# Altium schematic sheet CONNECTORS.SchDoc: =DocumentName
size B
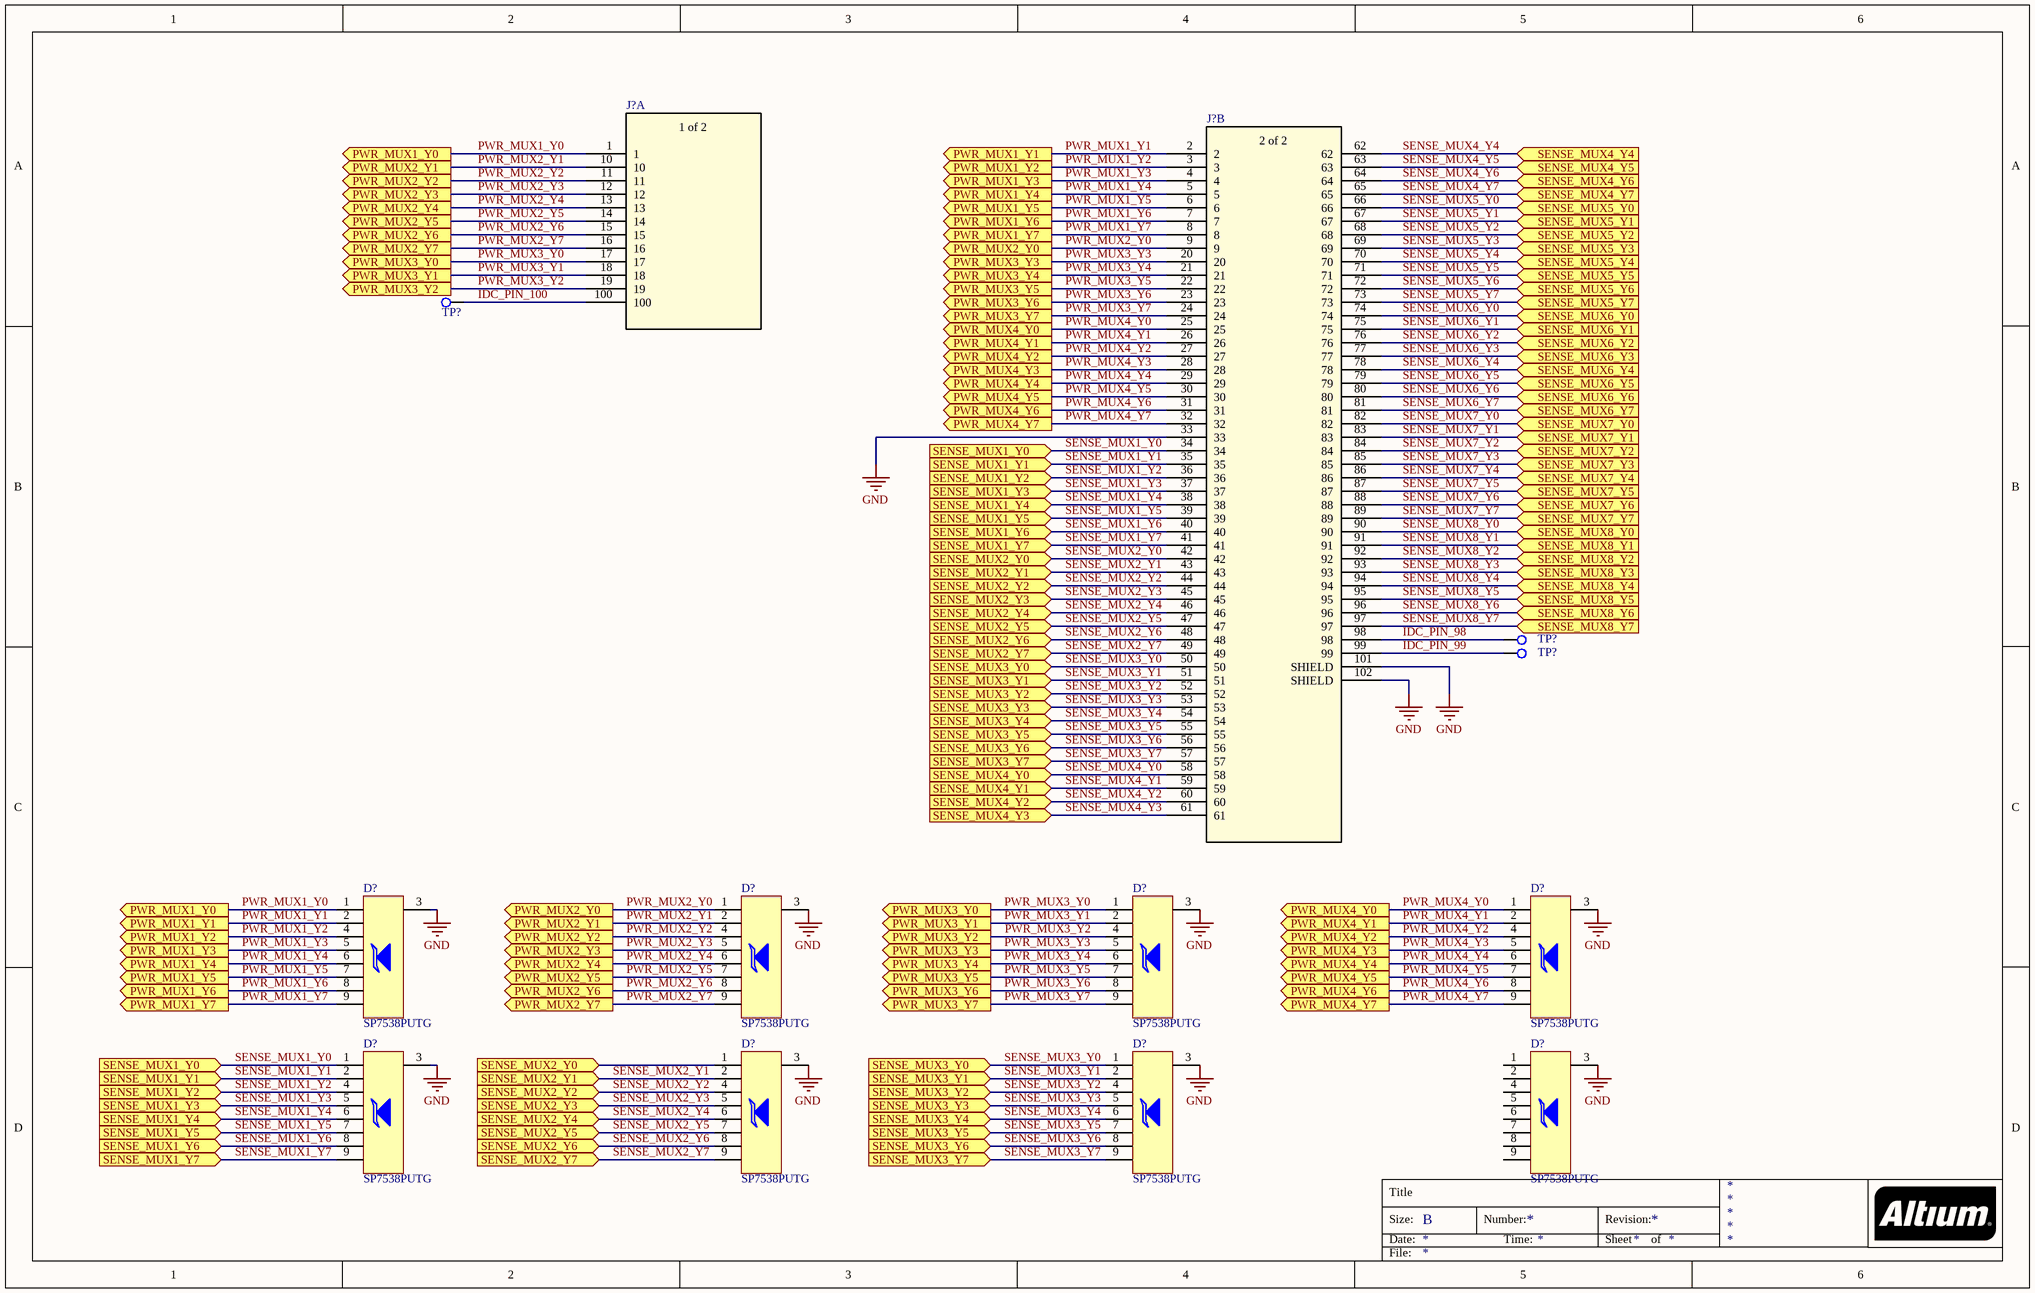
[diagram p0: CONNECTORS.SchDoc]

## Parts
(Parts that share a designator on the sheet are numbered #1, #2 ... from top to bottom, then left to right.)
D?#1  SP7538PUTG  [SP7538PUTG]
D?#2  SP7538PUTG  [SP7538PUTG]
D?#3  SP7538PUTG  [SP7538PUTG]
D?#4  SP7538PUTG  [SP7538PUTG]
D?#5  SP7538PUTG  [SP7538PUTG]
D?#6  SP7538PUTG  [SP7538PUTG]
D?#7  SP7538PUTG  [SP7538PUTG]
D?#8  SP7538PUTG  [SP7538PUTG]
J?#1  1-787082-8  [CONN100_1-787082-8_TEC]  (value not drawn)  (part A of 2)
J?#2  1-787082-8  [CONN100_1-787082-8_TEC]  (value not drawn)  (part B of 2)
TP?#1  RCU-0C  [TP+195X110]  (value not drawn)
TP?#2  RCU-0C  [TP+195X110]  (value not drawn)
TP?#3  RCU-0C  [TP+195X110]  (value not drawn)

## Ports
PWR_MUX1_Y0 (out), PWR_MUX1_Y1 (out), PWR_MUX1_Y2 (out), PWR_MUX1_Y3 (out), PWR_MUX1_Y4 (out), PWR_MUX1_Y5 (out), PWR_MUX1_Y6 (out), PWR_MUX1_Y7 (out), PWR_MUX2_Y0 (out), PWR_MUX2_Y1 (out), PWR_MUX2_Y2 (out), PWR_MUX2_Y3 (out), PWR_MUX2_Y4 (out), PWR_MUX2_Y5 (out), PWR_MUX2_Y6 (out), PWR_MUX2_Y7 (out), PWR_MUX3_Y0 (out), PWR_MUX3_Y1 (out), PWR_MUX3_Y2 (out), PWR_MUX3_Y3 (out), PWR_MUX3_Y4 (out), PWR_MUX3_Y5 (out), PWR_MUX3_Y6 (out), PWR_MUX3_Y7 (out), PWR_MUX4_Y0 (out), PWR_MUX4_Y1 (out), PWR_MUX4_Y2 (out), PWR_MUX4_Y3 (out), PWR_MUX4_Y4 (out), PWR_MUX4_Y5 (out), PWR_MUX4_Y6 (out), PWR_MUX4_Y7 (out), SENSE_MUX1_Y0 (in), SENSE_MUX1_Y1 (in), SENSE_MUX1_Y2 (in), SENSE_MUX1_Y3 (in), SENSE_MUX1_Y4 (in), SENSE_MUX1_Y5 (in), SENSE_MUX1_Y6 (in), SENSE_MUX1_Y7 (in), SENSE_MUX2_Y0 (in), SENSE_MUX2_Y1 (in), SENSE_MUX2_Y2 (in), SENSE_MUX2_Y3 (in), SENSE_MUX2_Y4 (in), SENSE_MUX2_Y5 (in), SENSE_MUX2_Y6 (in), SENSE_MUX2_Y7 (in), SENSE_MUX3_Y0 (in), SENSE_MUX3_Y1 (in), SENSE_MUX3_Y2 (in), SENSE_MUX3_Y3 (in), SENSE_MUX3_Y4 (in), SENSE_MUX3_Y5 (in), SENSE_MUX3_Y6 (in), SENSE_MUX3_Y7 (in), SENSE_MUX4_Y0 (in), SENSE_MUX4_Y1 (in), SENSE_MUX4_Y2 (in), SENSE_MUX4_Y3 (in), SENSE_MUX4_Y4 (in), SENSE_MUX4_Y5 (in), SENSE_MUX4_Y6 (in), SENSE_MUX4_Y7 (in), SENSE_MUX5_Y0 (in), SENSE_MUX5_Y1 (in), SENSE_MUX5_Y2 (in), SENSE_MUX5_Y3 (in), SENSE_MUX5_Y4 (in), SENSE_MUX5_Y5 (in), SENSE_MUX5_Y6 (in), SENSE_MUX5_Y7 (in), SENSE_MUX6_Y0 (in), SENSE_MUX6_Y1 (in), SENSE_MUX6_Y2 (in), SENSE_MUX6_Y3 (in), SENSE_MUX6_Y4 (in), SENSE_MUX6_Y5 (in), SENSE_MUX6_Y6 (in), SENSE_MUX6_Y7 (in), SENSE_MUX7_Y0 (in), SENSE_MUX7_Y1 (in), SENSE_MUX7_Y2 (in), SENSE_MUX7_Y3 (in), SENSE_MUX7_Y4 (in), SENSE_MUX7_Y5 (in), SENSE_MUX7_Y6 (in), SENSE_MUX7_Y7 (in), SENSE_MUX8_Y0 (in), SENSE_MUX8_Y1 (in), SENSE_MUX8_Y2 (in), SENSE_MUX8_Y3 (in), SENSE_MUX8_Y4 (in), SENSE_MUX8_Y5 (in), SENSE_MUX8_Y6 (in), SENSE_MUX8_Y7 (in)

## Nets
GND: D?#1.3 D?#2.3 D?#3.3 D?#4.3 D?#5.3 D?#6.3 D?#7.3 D?#8.3 J?#2.33 J?#2.101(SHIELD) J?#2.102(SHIELD)
IDC_PIN_98: J?#2.98
IDC_PIN_99: J?#2.99
IDC_PIN_100: J?#1.100
PWR_MUX1_Y0: D?#1.1 J?#1.1 ; port PWR_MUX1_Y0
PWR_MUX1_Y1: D?#1.2 J?#2.2 ; port PWR_MUX1_Y1
PWR_MUX1_Y2: D?#1.4 J?#2.3 ; port PWR_MUX1_Y2
PWR_MUX1_Y3: D?#1.5 J?#2.4 ; port PWR_MUX1_Y3
PWR_MUX1_Y4: D?#1.6 J?#2.5 ; port PWR_MUX1_Y4
PWR_MUX1_Y5: D?#1.7 J?#2.6 ; port PWR_MUX1_Y5
PWR_MUX1_Y6: D?#1.8 J?#2.7 ; port PWR_MUX1_Y6
PWR_MUX1_Y7: D?#1.9 J?#2.8 ; port PWR_MUX1_Y7
PWR_MUX2_Y0: D?#2.1 J?#2.9 ; port PWR_MUX2_Y0
PWR_MUX2_Y1: D?#2.2 J?#1.10 ; port PWR_MUX2_Y1
PWR_MUX2_Y2: D?#2.4 J?#1.11 ; port PWR_MUX2_Y2
PWR_MUX2_Y3: D?#2.5 J?#1.12 ; port PWR_MUX2_Y3
PWR_MUX2_Y4: D?#2.6 J?#1.13 ; port PWR_MUX2_Y4
PWR_MUX2_Y5: D?#2.7 J?#1.14 ; port PWR_MUX2_Y5
PWR_MUX2_Y6: D?#2.8 J?#1.15 ; port PWR_MUX2_Y6
PWR_MUX2_Y7: D?#2.9 J?#1.16 ; port PWR_MUX2_Y7
PWR_MUX3_Y0: D?#3.1 J?#1.17 ; port PWR_MUX3_Y0
PWR_MUX3_Y1: D?#3.2 J?#1.18 ; port PWR_MUX3_Y1
PWR_MUX3_Y2: D?#3.4 J?#1.19 ; port PWR_MUX3_Y2
PWR_MUX3_Y3: D?#3.5 J?#2.20 ; port PWR_MUX3_Y3
PWR_MUX3_Y4: D?#3.6 J?#2.21 ; port PWR_MUX3_Y4
PWR_MUX3_Y5: D?#3.7 J?#2.22 ; port PWR_MUX3_Y5
PWR_MUX3_Y6: D?#3.8 J?#2.23 ; port PWR_MUX3_Y6
PWR_MUX3_Y7: D?#3.9 J?#2.24 ; port PWR_MUX3_Y7
PWR_MUX4_Y0: D?#4.1 J?#2.25 ; port PWR_MUX4_Y0
PWR_MUX4_Y1: D?#4.2 J?#2.26 ; port PWR_MUX4_Y1
PWR_MUX4_Y2: D?#4.4 J?#2.27 ; port PWR_MUX4_Y2
PWR_MUX4_Y3: D?#4.5 J?#2.28 ; port PWR_MUX4_Y3
PWR_MUX4_Y4: D?#4.6 J?#2.29 ; port PWR_MUX4_Y4
PWR_MUX4_Y5: D?#4.7 J?#2.30 ; port PWR_MUX4_Y5
PWR_MUX4_Y6: D?#4.8 J?#2.31 ; port PWR_MUX4_Y6
PWR_MUX4_Y7: D?#4.9 J?#2.32 ; port PWR_MUX4_Y7
SENSE_MUX1_Y0: D?#5.1 J?#2.34 ; port SENSE_MUX1_Y0
SENSE_MUX1_Y1: D?#5.2 J?#2.35 ; port SENSE_MUX1_Y1
SENSE_MUX1_Y2: D?#5.4 J?#2.36 ; port SENSE_MUX1_Y2
SENSE_MUX1_Y3: D?#5.5 J?#2.37 ; port SENSE_MUX1_Y3
SENSE_MUX1_Y4: D?#5.6 J?#2.38 ; port SENSE_MUX1_Y4
SENSE_MUX1_Y5: D?#5.7 J?#2.39 ; port SENSE_MUX1_Y5
SENSE_MUX1_Y6: D?#5.8 J?#2.40 ; port SENSE_MUX1_Y6
SENSE_MUX1_Y7: D?#5.9 J?#2.41 ; port SENSE_MUX1_Y7
SENSE_MUX2_Y0: D?#6.1 J?#2.42 ; port SENSE_MUX2_Y0
SENSE_MUX2_Y1: D?#6.2 J?#2.43 ; port SENSE_MUX2_Y1
SENSE_MUX2_Y2: D?#6.4 J?#2.44 ; port SENSE_MUX2_Y2
SENSE_MUX2_Y3: D?#6.5 J?#2.45 ; port SENSE_MUX2_Y3
SENSE_MUX2_Y4: D?#6.6 J?#2.46 ; port SENSE_MUX2_Y4
SENSE_MUX2_Y5: D?#6.7 J?#2.47 ; port SENSE_MUX2_Y5
SENSE_MUX2_Y6: D?#6.8 J?#2.48 ; port SENSE_MUX2_Y6
SENSE_MUX2_Y7: D?#6.9 J?#2.49 ; port SENSE_MUX2_Y7
SENSE_MUX3_Y0: D?#7.1 J?#2.50 ; port SENSE_MUX3_Y0
SENSE_MUX3_Y1: D?#7.2 J?#2.51 ; port SENSE_MUX3_Y1
SENSE_MUX3_Y2: D?#7.4 J?#2.52 ; port SENSE_MUX3_Y2
SENSE_MUX3_Y3: D?#7.5 J?#2.53 ; port SENSE_MUX3_Y3
SENSE_MUX3_Y4: D?#7.6 J?#2.54 ; port SENSE_MUX3_Y4
SENSE_MUX3_Y5: D?#7.7 J?#2.55 ; port SENSE_MUX3_Y5
SENSE_MUX3_Y6: D?#7.8 J?#2.56 ; port SENSE_MUX3_Y6
SENSE_MUX3_Y7: D?#7.9 J?#2.57 ; port SENSE_MUX3_Y7
SENSE_MUX4_Y0: J?#2.58 ; port SENSE_MUX4_Y0
SENSE_MUX4_Y1: J?#2.59 ; port SENSE_MUX4_Y1
SENSE_MUX4_Y2: J?#2.60 ; port SENSE_MUX4_Y2
SENSE_MUX4_Y3: J?#2.61 ; port SENSE_MUX4_Y3
SENSE_MUX4_Y4: J?#2.62 ; port SENSE_MUX4_Y4
SENSE_MUX4_Y5: J?#2.63 ; port SENSE_MUX4_Y5
SENSE_MUX4_Y6: J?#2.64 ; port SENSE_MUX4_Y6
SENSE_MUX4_Y7: J?#2.65 ; port SENSE_MUX4_Y7
SENSE_MUX5_Y0: J?#2.66 ; port SENSE_MUX5_Y0
SENSE_MUX5_Y1: J?#2.67 ; port SENSE_MUX5_Y1
SENSE_MUX5_Y2: J?#2.68 ; port SENSE_MUX5_Y2
SENSE_MUX5_Y3: J?#2.69 ; port SENSE_MUX5_Y3
SENSE_MUX5_Y4: J?#2.70 ; port SENSE_MUX5_Y4
SENSE_MUX5_Y5: J?#2.71 ; port SENSE_MUX5_Y5
SENSE_MUX5_Y6: J?#2.72 ; port SENSE_MUX5_Y6
SENSE_MUX5_Y7: J?#2.73 ; port SENSE_MUX5_Y7
SENSE_MUX6_Y0: J?#2.74 ; port SENSE_MUX6_Y0
SENSE_MUX6_Y1: J?#2.75 ; port SENSE_MUX6_Y1
SENSE_MUX6_Y2: J?#2.76 ; port SENSE_MUX6_Y2
SENSE_MUX6_Y3: J?#2.77 ; port SENSE_MUX6_Y3
SENSE_MUX6_Y4: J?#2.78 ; port SENSE_MUX6_Y4
SENSE_MUX6_Y5: J?#2.79 ; port SENSE_MUX6_Y5
SENSE_MUX6_Y6: J?#2.80 ; port SENSE_MUX6_Y6
SENSE_MUX6_Y7: J?#2.81 ; port SENSE_MUX6_Y7
SENSE_MUX7_Y0: J?#2.82 ; port SENSE_MUX7_Y0
SENSE_MUX7_Y1: J?#2.83 ; port SENSE_MUX7_Y1
SENSE_MUX7_Y2: J?#2.84 ; port SENSE_MUX7_Y2
SENSE_MUX7_Y3: J?#2.85 ; port SENSE_MUX7_Y3
SENSE_MUX7_Y4: J?#2.86 ; port SENSE_MUX7_Y4
SENSE_MUX7_Y5: J?#2.87 ; port SENSE_MUX7_Y5
SENSE_MUX7_Y6: J?#2.88 ; port SENSE_MUX7_Y6
SENSE_MUX7_Y7: J?#2.89 ; port SENSE_MUX7_Y7
SENSE_MUX8_Y0: J?#2.90 ; port SENSE_MUX8_Y0
SENSE_MUX8_Y1: J?#2.91 ; port SENSE_MUX8_Y1
SENSE_MUX8_Y2: J?#2.92 ; port SENSE_MUX8_Y2
SENSE_MUX8_Y3: J?#2.93 ; port SENSE_MUX8_Y3
SENSE_MUX8_Y4: J?#2.94 ; port SENSE_MUX8_Y4
SENSE_MUX8_Y5: J?#2.95 ; port SENSE_MUX8_Y5
SENSE_MUX8_Y6: J?#2.96 ; port SENSE_MUX8_Y6
SENSE_MUX8_Y7: J?#2.97 ; port SENSE_MUX8_Y7

Not connected (* = marked no-connect by the designer): D?#8 1 2 4 5 6 7 8 9; TP?#1 1; TP?#2 1; TP?#3 1

## Notes on the sheet
- Title
- Size:
- Date:
- B
- Number:
- Time:
- Revision:
- Sheet
- of
- File:
- (in symbol 1-787082-8, part A) 1 of 2
- (in symbol 1-787082-8, part B) 2 of 2

## Library data of the parts
D?#1-D?#8 = SP7538PUTG: ESD Suppressor TVS Octal Uni-Dir 25kV 9-Pin UDFN T/R; Manufacturer: Littelfuse; Number of Unidirectional Channels: 8; Reverse Standoff Voltage: 5V; Clamping Voltage: 7V; Peak Pulse Current: 2A; Power Line Protection: Yes; Supplier: Digi-Key; RoHS: Yes; Category: TVS Diodes; Stock 1: 40273; Pricing 1: 1=0.95000, 10=0.85200, 100=0.66410, 500=0.54862, 1000=0.43838 (USD); Mount: Surface Mount; Number of Pins: 9; Min Operating Temperature: -40°C; Max Operating Temperature: 150°C; Packaging: Cut Tape; RoHS Compliant: Yes; ComponentLink1URL: http://www.littelfuse.com/~/media/electronics/datasheets/tvs_diode_arrays/littelfuse_tvs_diode_array_sp7538p_datasheet.pdf.pdf?src-supplier=Farnell; ComponentLink1Description: http://www.littelfuse.com/~/media/electronics/datasheets/tvs_diode_arrays/littelfuse_tvs_diode_array_sp7538p_datasheet.pdf.pdf?src-supplier=Farnell; ComponentLink2URL: http://www.littelfuse.com/~/media/electronics/datasheets/tvs_diode_arrays/littelfuse_tvs_diode_array_sp7538p_datasheet.pdf.pdf?src-supplier=Digi-Key; ComponentLink2Description: http://www.littelfuse.com/~/media/electronics/datasheets/tvs_diode_arrays/littelfuse_tvs_diode_array_sp7538p_datasheet.pdf.pdf?src-supplier=Digi-Key; ComponentLink3URL: https://www.littelfuse.com/~/media/electronics/datasheets/tvs_diode_arrays/littelfuse_tvs_diode_array_sp7538p_datasheet.pdf.pdf?src-supplier=Digi-Key; ComponentLink3Description: https://www.littelfuse.com/~/media/electronics/datasheets/tvs_diode_arrays/littelfuse_tvs_diode_array_sp7538p_datasheet.pdf.pdf?src-supplier=Digi-Key; ComponentLink4URL: http://www.littelfuse.com/~/media/electronics/datasheets/tvs_diode_arrays/littelfuse_tvs_diode_array_sp7538p_datasheet.pdf.pdf?src-supplier=Arrow+Electronics; ComponentLink4Description: http://www.littelfuse.com/~/media/electronics/datasheets/tvs_diode_arrays/littelfuse_tvs_diode_array_sp7538p_datasheet.pdf.pdf?src-supplier=Arrow+Electronics; ComponentLink5URL: http://www.littelfuse.com/~/media/electronics/datasheets/tvs_diode_arrays/littelfuse_tvs_diode_array_sp7538p_datasheet.pdf.pdf?src-supplier=Mouser; ComponentLink5Description: http://www.littelfuse.com/~/media/electronics/datasheets/tvs_diode_arrays/littelfuse_tvs_diode_array_sp7538p_datasheet.pdf.pdf?src-supplier=Mouser; ComponentLink6URL: http://www.littelfuse.com/~/media/electronics/datasheets/tvs_diode_arrays/littelfuse_tvs_diode_array_sp7538p_datasheet.pdf.pdf?src-supplier=Verical; ComponentLink6Description: http://www.littelfuse.com/~/media/electronics/datasheets/tvs_diode_arrays/littelfuse_tvs_diode_array_sp7538p_datasheet.pdf.pdf?src-supplier=Verical; ComponentLink7URL: http://www.littelfuse.com/~/media/electronics/datasheets/tvs_diode_arrays/littelfuse_tvs_diode_array_sp7538p_datasheet.pdf.pdf?src-supplier=Newark; ComponentLink7Description: http://www.littelfuse.com/~/media/electronics/datasheets/tvs_diode_arrays/littelfuse_tvs_diode_array_sp7538p_datasheet.pdf.pdf?src-supplier=Newark; ComponentLink8URL: http://www.littelfuse.com/~/media/electronics/datasheets/tvs_diode_arrays/littelfuse_tvs_diode_array_sp7538p_datasheet.pdf.pdf?src-supplier=TTI; ComponentLink8Description: http://www.littelfuse.com/~/media/electronics/datasheets/tvs_diode_arrays/littelfuse_tvs_diode_array_sp7538p_datasheet.pdf.pdf?src-supplier=TTI; Supplier Part Number: F7417CT-ND; Manufacturer Part Number: SP7538PUTG
J?#1 J?#2 = 1-787082-8: No Description Available; Mfr_Name: TE Connectivity; Copyright: Copyright (C) 2022 Ultra Librarian. All rights reserved.; Manufacturer_Part_Number: 1-787082-8; Digi-Key_Part_Number_1: A35091-ND; RefDes: RefDes; Type: DEV
TP?#1-TP?#3 = RCU-0C: Natural PC Test Point , Plating Surface Mount Mounting Type; Manufacturer: TE Connectivity AMP Connectors; Value: *; Package: SON-6 TE Connectivity AMP Connectors; Purchase-URL: https://pricing.snapeda.com/search/part/RCU-0C/?ref=eda; Supplier Part Number: A106145CT-ND; Check_prices: https://www.snapeda.com/parts/RCU-0C/TE%20Connectivity/view-part/4791537/?ref=eda; Manufacturer Part Number: RCU-0C; SnapEDA_Link: https://www.snapeda.com/parts/RCU-0C/TE%20Connectivity/view-part/4791537/?ref=snap; Supplier: Digi-Key